# Altium project Time Circuit Display.PrjPcb
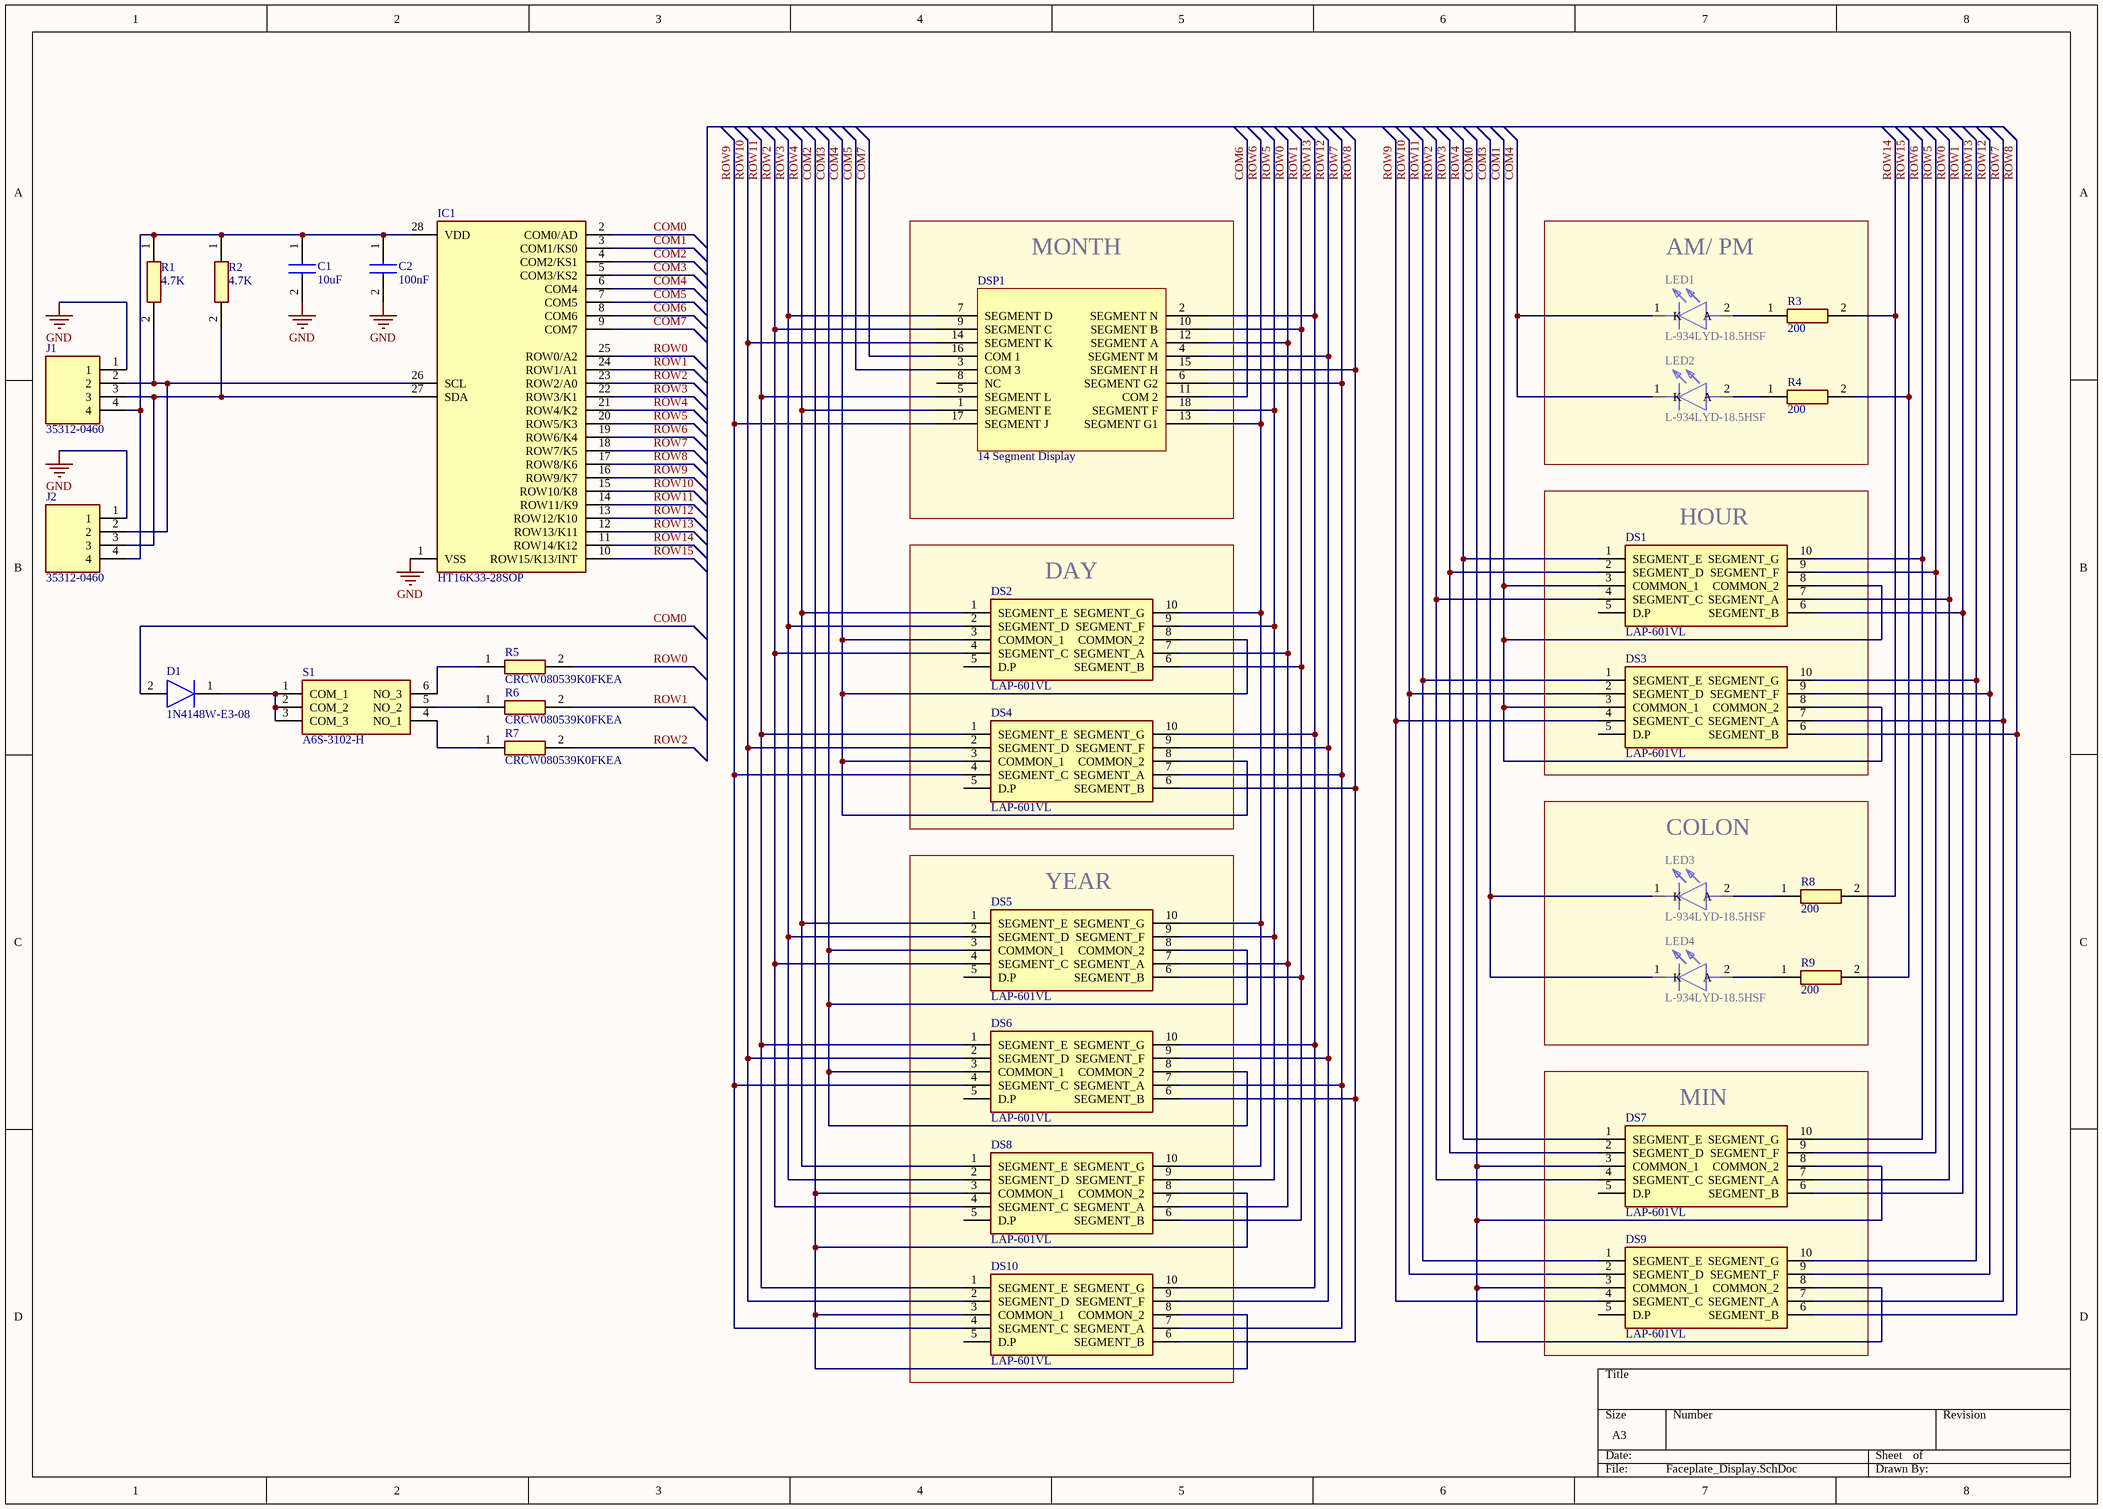
[diagram p0: Faceplate_Display.SchDoc]
1 sheet, 31 parts. Net scope: global (net labels, ports and power ports of the same name join across sheets).
Board file: Faceplate_Display.PcbDoc

## Sheet Faceplate_Display.SchDoc
size A3

### Parts
C1  10uF  [CAPC2012X145N]
C2  100nF  [CAPC2012X88N]
D1  1N4148W-E3-08  [SOD3716X135N]
DS1  LAP-601VL  [DIPS1524W50P254L1225H830Q10N]
DS2  LAP-601VL  [DIPS1524W50P254L1225H830Q10N]
DS3  LAP-601VL  [DIPS1524W50P254L1225H830Q10N]
DS4  LAP-601VL  [DIPS1524W50P254L1225H830Q10N]
DS5  LAP-601VL  [DIPS1524W50P254L1225H830Q10N]
DS6  LAP-601VL  [DIPS1524W50P254L1225H830Q10N]
DS7  LAP-601VL  [DIPS1524W50P254L1225H830Q10N]
DS8  LAP-601VL  [DIPS1524W50P254L1225H830Q10N]
DS9  LAP-601VL  [DIPS1524W50P254L1225H830Q10N]
DS10  LAP-601VL  [DIPS1524W50P254L1225H830Q10N]
DSP1  14 Segment Display  [14 Segment Display CS]
IC1  HT16K33-28SOP  [SOIC127P1031X264-28N]
J1  35312-0460  [SHDR4W64P0X250_1X4_1246X650X700P]
J2  35312-0460  [SHDR4W64P0X250_1X4_1246X650X700P]
LED1  L-934LYD-18.5HSF  [L934LYD185HSF]
LED2  L-934LYD-18.5HSF  [L934LYD185HSF]
LED3  L-934LYD-18.5HSF  [L934LYD185HSF]
LED4  L-934LYD-18.5HSF  [L934LYD185HSF]
R1  4.7K  [RESC2012X50N]
R2  4.7K  [RESC2012X50N]
R3  200  [RESC2012X60N]
R4  200  [RESC2012X60N]
R5  CRCW080539K0FKEA  [RESC2012X50N]
R6  CRCW080539K0FKEA  [RESC2012X50N]
R7  CRCW080539K0FKEA  [RESC2012X50N]
R8  200  [RESC2012X60N]
R9  200  [RESC2012X60N]
S1  A6S-3102-H  [SOP254P980X380-6N]

### Blocks framed on the sheet
MONTH: DSP1
AM/ PM: LED1 LED2 R3 R4
HOUR: DS1 DS3
DAY: DS2 DS4
COLON: LED3 LED4 R8 R9
YEAR: DS5 DS6 DS8 DS10
MIN: DS7 DS9

### Nets
GND: C1.2 C2.2 IC1.1(VSS) J1.1 J2.1
COM0: D1.2(A) DS7.3(COMMON_1) DS7.8(COMMON_2) DS9.3(COMMON_1) DS9.8(COMMON_2) IC1.2(COM0/AD)
COM1: DS1.3(COMMON_1) DS1.8(COMMON_2) DS3.3(COMMON_1) DS3.8(COMMON_2) IC1.3(COM1/KS0)
COM2: DS8.3(COMMON_1) DS8.8(COMMON_2) DS10.3(COMMON_1) DS10.8(COMMON_2) IC1.4(COM2/KS1)
COM3: DS5.3(COMMON_1) DS5.8(COMMON_2) DS6.3(COMMON_1) DS6.8(COMMON_2) IC1.5(COM3/KS2) LED3.1(K) LED4.1(K)
COM4: DS2.3(COMMON_1) DS2.8(COMMON_2) DS4.3(COMMON_1) DS4.8(COMMON_2) IC1.6(COM4) LED1.1(K) LED2.1(K)
COM5: DSP1.3(COM_3) IC1.7(COM5)
COM6: DSP1.11(COM_2) IC1.8(COM6)
COM7: DSP1.16(COM_1) IC1.9(COM7)
ROW0: DS1.7(SEGMENT_A) DS2.7(SEGMENT_A) DS5.7(SEGMENT_A) DS7.7(SEGMENT_A) DS8.7(SEGMENT_A) DSP1.12(SEGMENT_A) IC1.25(ROW0/A2) R5.2
ROW1: DS1.6(SEGMENT_B) DS2.6(SEGMENT_B) DS5.6(SEGMENT_B) DS7.6(SEGMENT_B) DS8.6(SEGMENT_B) DSP1.10(SEGMENT_B) IC1.24(ROW1/A1) R6.2
ROW2: DS1.4(SEGMENT_C) DS2.4(SEGMENT_C) DS5.4(SEGMENT_C) DS7.4(SEGMENT_C) DS8.4(SEGMENT_C) DSP1.9(SEGMENT_C) IC1.23(ROW2/A0) R7.2
ROW3: DS1.2(SEGMENT_D) DS2.2(SEGMENT_D) DS5.2(SEGMENT_D) DS7.2(SEGMENT_D) DS8.2(SEGMENT_D) DSP1.7(SEGMENT_D) IC1.22(ROW3/K1)
ROW4: DS1.1(SEGMENT_E) DS2.1(SEGMENT_E) DS5.1(SEGMENT_E) DS7.1(SEGMENT_E) DS8.1(SEGMENT_E) DSP1.1(SEGMENT_E) IC1.21(ROW4/K2)
ROW5: DS1.9(SEGMENT_F) DS2.9(SEGMENT_F) DS5.9(SEGMENT_F) DS7.9(SEGMENT_F) DS8.9(SEGMENT_F) DSP1.18(SEGMENT_F) IC1.20(ROW5/K3)
ROW6: DS1.10(SEGMENT_G) DS2.10(SEGMENT_G) DS5.10(SEGMENT_G) DS7.10(SEGMENT_G) DS8.10(SEGMENT_G) DSP1.13(SEGMENT_G1) IC1.19(ROW6/K4)
ROW7: DS3.7(SEGMENT_A) DS4.7(SEGMENT_A) DS6.7(SEGMENT_A) DS9.7(SEGMENT_A) DS10.7(SEGMENT_A) DSP1.6(SEGMENT_G2) IC1.18(ROW7/K5)
ROW8: DS3.6(SEGMENT_B) DS4.6(SEGMENT_B) DS6.6(SEGMENT_B) DS9.6(SEGMENT_B) DS10.6(SEGMENT_B) DSP1.15(SEGMENT_H) IC1.17(ROW8/K6)
ROW9: DS3.4(SEGMENT_C) DS4.4(SEGMENT_C) DS6.4(SEGMENT_C) DS9.4(SEGMENT_C) DS10.4(SEGMENT_C) DSP1.17(SEGMENT_J) IC1.16(ROW9/K7)
ROW10: DS3.2(SEGMENT_D) DS4.2(SEGMENT_D) DS6.2(SEGMENT_D) DS9.2(SEGMENT_D) DS10.2(SEGMENT_D) DSP1.14(SEGMENT_K) IC1.15(ROW10/K8)
ROW11: DS3.1(SEGMENT_E) DS4.1(SEGMENT_E) DS6.1(SEGMENT_E) DS9.1(SEGMENT_E) DS10.1(SEGMENT_E) DSP1.5(SEGMENT_L) IC1.14(ROW11/K9)
ROW12: DS3.9(SEGMENT_F) DS4.9(SEGMENT_F) DS6.9(SEGMENT_F) DS9.9(SEGMENT_F) DS10.9(SEGMENT_F) DSP1.4(SEGMENT_M) IC1.13(ROW12/K10)
ROW13: DS3.10(SEGMENT_G) DS4.10(SEGMENT_G) DS6.10(SEGMENT_G) DS9.10(SEGMENT_G) DS10.10(SEGMENT_G) DSP1.2(SEGMENT_N) IC1.12(ROW13/K11)
ROW14: IC1.11(ROW14/K12) R3.2 R8.2
ROW15: IC1.10(ROW15/K13/INT) R4.2 R9.2
NetC1_1: C1.1 C2.1 IC1.28(VDD) J1.4 J2.4 R1.1 R2.1
NetD1_1: D1.1(K) S1.1(COM_1) S1.2(COM_2) S1.3(COM_3)
NetIC1_26: IC1.26(SCL) J1.2 J2.2 R1.2
NetIC1_27: IC1.27(SDA) J1.3 J2.3 R2.2
NetLED1_2: LED1.2(A) R3.1
NetLED2_2: LED2.2(A) R4.1
NetLED3_2: LED3.2(A) R8.1
NetLED4_2: LED4.2(A) R9.1
NetR5_1: R5.1 S1.6(NO_3)
NetR6_1: R6.1 S1.5(NO_2)
NetR7_1: R7.1 S1.4(NO_1)

Not connected (* = marked no-connect by the designer): DS1 5(D.P); DS2 5(D.P); DS3 5(D.P); DS4 5(D.P); DS5 5(D.P); DS6 5(D.P); DS7 5(D.P); DS8 5(D.P); DS9 5(D.P); DS10 5(D.P); DSP1 8(NC)

### Library data of the parts
C1 = VJ0805Y104KXAAT: Capacitor; Manufacturer_Name: Vishay; Datasheet Link: http://www.vishay.com/docs/45226/vj31xrohsautomlcc.pdf; Height: 1.45mm; Manufacturer_Part_Number: VJ0805Y104KXAAT; Arrow Part Number: VJ0805Y104KXAAT; Arrow Price/Stock: https://www.arrow.com/en/products/vj0805y104kxaat/vishay; Mouser Part Number: 77-VJ0805Y104KXAAT; Mouser Price/Stock: https://www.mouser.com/Search/Refine.aspx?Keyword=77-VJ0805Y104KXAAT
C2 = C0805C104K4RACTU: Capacitor; Manufacturer_Name: Kemet; Datasheet Link: http://docs-emea.rs-online.com/webdocs/134c/0900766b8134ce68.pdf; Height: 0.88mm; Manufacturer_Part_Number: C0805C104K4RACTU; Arrow Part Number: C0805C104K4RACTU; Arrow Price/Stock: https://www.arrow.com/en/products/c0805c104k4ractu/kemet-corporation; Mouser Part Number: 80-C0805C104K4R; Mouser Price/Stock: https://www.mouser.co.uk/ProductDetail/KEMET/C0805C104K4RACTU?qs=Pc30aiB8zWWfqQNJWggt%252BA%3D%3D
D1 = 1N4148W-E3-08: Diode; Manufacturer_Name: Vishay; Datasheet Link: http://www.vishay.com/docs/85748/1n4148w.pdf; Height: 1.35mm; Manufacturer_Part_Number: 1N4148W-E3-08; Arrow Part Number: 1N4148W-E3-08; Arrow Price/Stock: https://www.arrow.com/en/products/1n4148w-e3-08/vishay; Mouser Part Number: 78-1N4148W-E3-08; Mouser Price/Stock: https://www.mouser.co.uk/ProductDetail/Vishay-Semiconductors/1N4148W-E3-08?qs=bTzheeSci6TVjpxfjjRVMw%3D%3D
DS1-DS10 = LAP-601VL: Display; Manufacturer_Name: ROHM Semiconductor; Datasheet Link: https://www.rohm.com/datasheet/LAP-601VL/lap-601bl; Height: 8.3mm; Manufacturer_Part_Number: LAP-601VL; Arrow Part Number: LAP-601VL; Mouser Part Number: 755-LAP-601VL; Mouser Price/Stock: https://www.mouser.com/Search/Refine.aspx?Keyword=755-LAP-601VL
IC1 = HT16K33-28SOP: Integrated Circuit; Manufacturer_Name: Holtek; Datasheet Link: http://uk.rs-online.com/web/p/products/8850765; Height: 2.64mm; Manufacturer_Part_Number: HT16K33-28SOP; Arrow Part Number: HT16K33-28SOP
J1 J2 = 35312-0460: Connector; Manufacturer_Name: Molex; Datasheet Link: https://www.molex.com/pdm_docs/sd/353120460_sd.pdf; Height: 7mm; Manufacturer_Part_Number: 35312-0460; Mouser Part Number: 538-35312-0460; Mouser Price/Stock: https://www.mouser.co.uk/ProductDetail/Molex/35312-0460?qs=K5bGVUuM57oIWvCwIBpyrQ%3D%3D
LED1-LED4 = L-934LYD-18.5HSF: LED; Manufacturer_Name: Kingbright; Datasheet Link: http://www.farnell.com/datasheets/67049.pdf?_ga=2.224383071.571097696.1558967808-1460281664.1558967808; Height: 4.9mm; Manufacturer_Part_Number: L-934LYD-18.5HSF; Arrow Part Number: L-934LYD-18.5HSF; Mouser Part Number: N/A; Mouser Price/Stock: https://www.mouser.com/Search/Refine.aspx?Keyword=N%2FA
R1 R2 = CRCW08054K70FKEAHP: Resistor; Manufacturer_Name: Vishay; Datasheet Link: http://uk.rs-online.com/web/p/products/8123574; Height: 0.5mm; Manufacturer_Part_Number: CRCW08054K70FKEAHP; Arrow Part Number: CRCW08054K70FKEAHP; Arrow Price/Stock: https://www.arrow.com/en/products/crcw08054k70fkeahp/vishay; Mouser Part Number: 71-CRCW08054K70FKEAH; Mouser Price/Stock: https://www.mouser.com/Search/Refine.aspx?Keyword=71-CRCW08054K70FKEAH
R3 R4 R8 R9 = ERA-6AEB201V: Resistor; Manufacturer_Name: Panasonic; Datasheet Link: https://industrial.panasonic.com/cdbs/www-data/pdf/RDM0000/AOA0000C307.pdf; Height: 0.6mm; Manufacturer_Part_Number: ERA-6AEB201V; Mouser Part Number: 667-ERA-6AEB201V; Mouser Price/Stock: https://www.mouser.com/Search/Refine.aspx?Keyword=667-ERA-6AEB201V
R5-R7 = CRCW080539K0FKEA: Resistor; Manufacturer_Name: Vishay; Datasheet Link: http://www.vishay.com/docs/20035/dcrcwe3.pdf; Height: 0.5mm; Manufacturer_Part_Number: CRCW080539K0FKEA; Arrow Part Number: CRCW080539K0FKEA; Mouser Part Number: 71-CRCW080539K0FKEA; Mouser Price/Stock: https://www.mouser.co.uk/ProductDetail/Vishay-Dale/CRCW080539K0FKEA?qs=kJXytlGtIWlXWBq67QQPjA%3D%3D
S1 = A6S-3102-H: Switch; Manufacturer_Name: Omron Electronics; Datasheet Link: https://omronfs.omron.com/en_US/ecb/products/pdf/en-a6s.pdf; Height: 3.8mm; Manufacturer_Part_Number: A6S-3102-H; Arrow Part Number: A6S-3102-H; Arrow Price/Stock: https://www.arrow.com/en/products/a6s-3102-h/omron; Mouser Part Number: 653-A6S-3102-H; Mouser Price/Stock: https://www.mouser.co.uk/ProductDetail/Omron-Electronics/A6S-3102-H?qs=ZP3UR5XsUoddRS6xZKF2wA%3D%3D